# Altium schematic sheet NG2092_USB_HUB.SchDoc: =project_title
size Tabloid; PageSetup: Record=PageOptions|CenterHorizontal=True|CenterVertical=True|PrintScale=0.73|XCorrection=1.00|YCorrection=1.00|PrintKind=0|BorderSize=5000000|LeftOffset=0|BottomOffset=0|Orientation=2|PaperLength=1000|PaperWidth=1000|Scale=100|PaperSource=7|PrintQuality=-4|MediaType=1|DitherType=10|PaperKind=A4|PrintScaleMode=1; CompanyName: Luxonis Holding; Organization: Luxonis Holding; Address1: 1925 Harmony Park Drive; Address2: Westminster, CO; Address3: 80234; Address4: United States; SheetNumber: 8; SheetTotal: 12
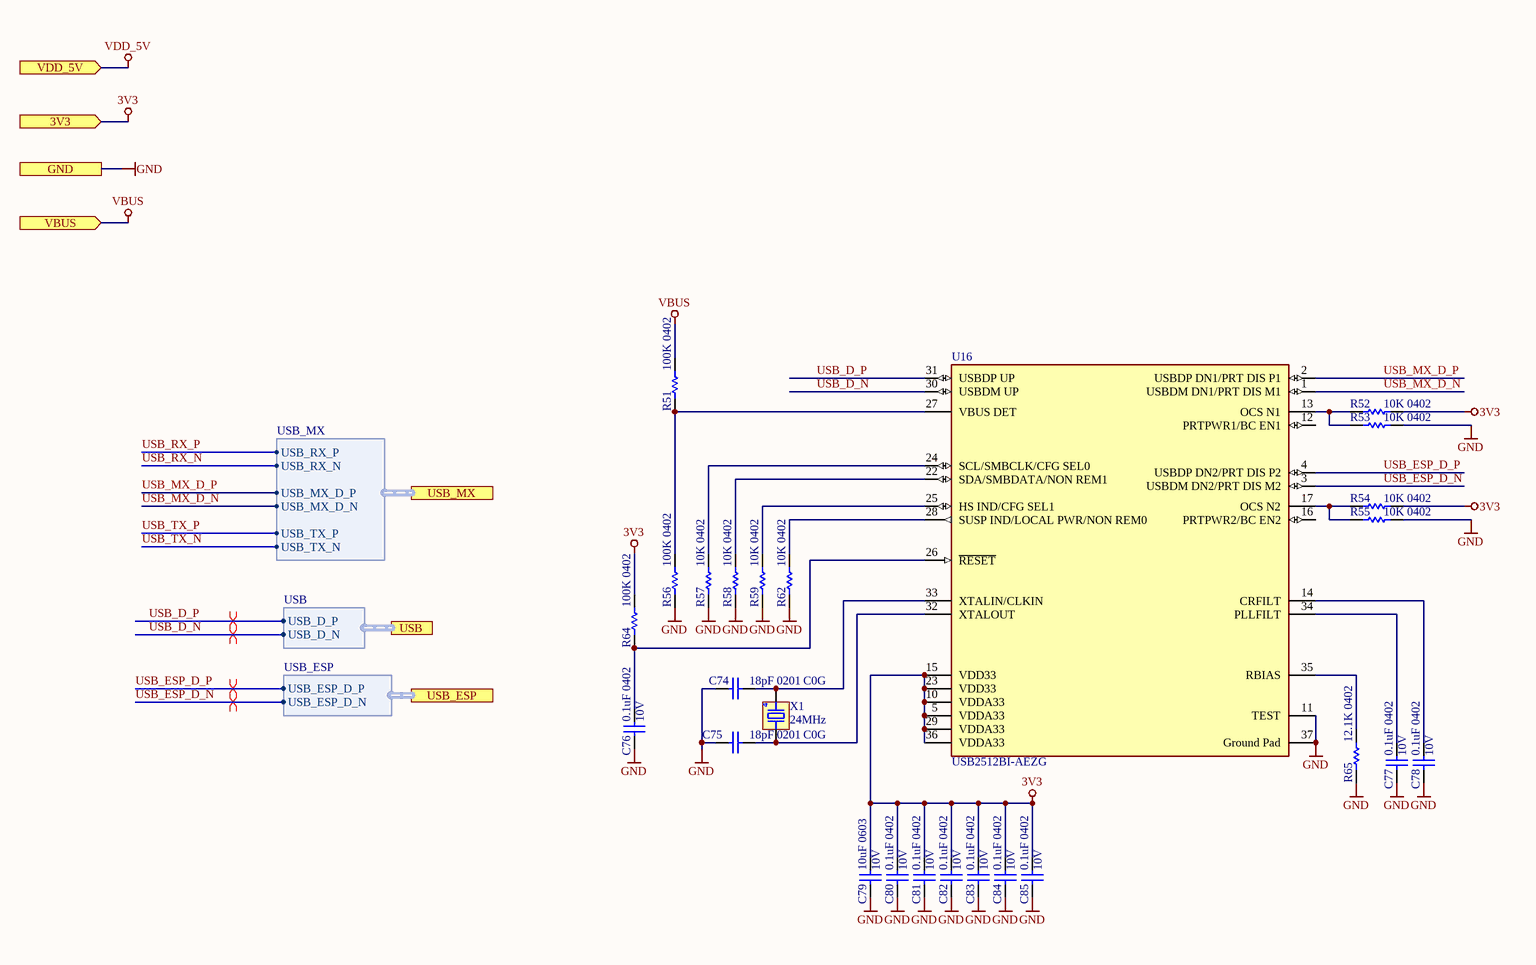
[diagram p0: NG2092_USB_HUB.SchDoc]

## Parts
C74  18pF 0201  Dielectric: C0G  [CAPC0201(0603)33_N]
C75  18pF 0201  Dielectric: C0G  [CAPC0201(0603)33_N]
C76  0.1uF 0402  Voltage Rating: 10V  [CAPC0402(1005)70_L]
C77  0.1uF 0402  Voltage Rating: 10V  [CAPC0402(1005)70_L]
C78  0.1uF 0402  Voltage Rating: 10V  [CAPC0402(1005)70_L]
C79  10uF 0603  Voltage Rating: 10V  [CAPC0603(1608)100_L]
C80  0.1uF 0402  Voltage Rating: 10V  [CAPC0402(1005)70_L]
C81  0.1uF 0402  Voltage Rating: 10V  [CAPC0402(1005)70_L]
C82  0.1uF 0402  Voltage Rating: 10V  [CAPC0402(1005)70_L]
C83  0.1uF 0402  Voltage Rating: 10V  [CAPC0402(1005)70_L]
C84  0.1uF 0402  Voltage Rating: 10V  [CAPC0402(1005)70_L]
C85  0.1uF 0402  Voltage Rating: 10V  [CAPC0402(1005)70_L]
R51  100K 0402  [RESC0402(1005)_L]
R52  10K 0402  [RESC0402(1005)_L]
R53  10K 0402  [RESC0402(1005)_L]
R54  10K 0402  [RESC0402(1005)_L]
R55  10K 0402  [RESC0402(1005)_L]
R56  100K 0402  [RESC0402(1005)_L]
R57  10K 0402  [RESC0402(1005)_L]
R58  10K 0402  [RESC0402(1005)_L]
R59  10K 0402  [RESC0402(1005)_L]
R62  10K 0402  [RESC0402(1005)_L]
R64  100K 0402  [RESC0402(1005)_L]
R65  12.1K 0402  [RESC0402(1005)_N]
U16  USB2512BI-AEZG  [QFN50P600X600X100_HS-37N]
X1  24MHz  [MCSJK-7U-24.00-12-30-60-B-30]

## Ports
3V3 (in), GND, USB (harness USB), USB_ESP (harness USB_ESP), USB_MX (harness USB_MX), VBUS (in), VDD_5V (in)

## Harnesses
USB: USB_D_P, USB_D_N
USB_ESP: USB_ESP_D_P, USB_ESP_D_N
USB_MX: USB_MX_D_P, USB_MX_D_N, USB_TX_N, USB_TX_P, USB_RX_N, USB_RX_P

## Nets
3V3: C79.2 C80.2 C81.2 C82.2 C83.2 C84.2 C85.2 R52.1 R54.1 R64.2 U16.5(VDDA33) U16.10(VDDA33) U16.15(VDD33) U16.23(VDD33) U16.29(VDDA33) U16.36(VDDA33) ; port 3V3
GND: C74.2 C75.2 C76.1 C77.1 C78.1 C79.1 C80.1 C81.1 C82.1 C83.1 C84.1 C85.1 R53.1 R55.1 R56.1 R57.1 R58.1 R59.1 R62.1 R65.1 U16.11(TEST) U16.37(Ground_Pad) ; port GND
VBUS: R51.2 ; port VBUS
VDD_5V: port VDD_5V
USB_D_N: U16.30(USBDM_UP) ; port USB.USB_D_N
USB_D_P: U16.31(USBDP_UP) ; port USB.USB_D_P
USB_ESP_D_N: U16.3(USBDM_DN2/PRT_DIS_M2) ; port USB_ESP.USB_ESP_D_N
USB_ESP_D_P: U16.4(USBDP_DN2/PRT_DIS_P2) ; port USB_ESP.USB_ESP_D_P
USB_MX_D_N: U16.1(USBDM_DN1/PRT_DIS_M1) ; port USB_MX.USB_MX_D_N
USB_MX_D_P: U16.2(USBDP_DN1/PRT_DIS_P1) ; port USB_MX.USB_MX_D_P
USB_RX_N: port USB_MX.USB_RX_N
USB_RX_P: port USB_MX.USB_RX_P
USB_TX_N: port USB_MX.USB_TX_N
USB_TX_P: port USB_MX.USB_TX_P
NetC74_1: C74.1 U16.33(XTALIN/CLKIN) X1.3(OSC2)
NetC75_1: C75.1 U16.32(XTALOUT) X1.1(OSC1)
NetC76_2: C76.2 R64.1 U16.26(~{RESET})
NetC77_2: C77.2 U16.34(PLLFILT)
NetC78_2: C78.2 U16.14(CRFILT)
NetR51_1: R51.1 R56.2 U16.27(VBUS_DET)
NetR52_2: R52.2 R53.2 U16.13(OCS_N1)
NetR54_2: R54.2 R55.2 U16.17(OCS_N2)
NetR57_2: R57.2 U16.24(SCL/SMBCLK/CFG_SEL0)
NetR58_2: R58.2 U16.22(SDA/SMBDATA/NON_REM1)
NetR59_2: R59.2 U16.25(HS_IND/CFG_SEL1)
NetR62_2: R62.2 U16.28(SUSP_IND/LOCAL_PWR/NON_REM0)
NetR65_2: R65.2 U16.35(RBIAS)

Not connected (* = marked no-connect by the designer): U16 6(NC) 7(NC) 8(NC) 9(NC) 12(PRTPWR1/BC_EN1) 16(PRTPWR2/BC_EN2) 18(NC) 19(NC) 20(NC) 21(NC); X1 2(GND) 4(GND)

## Layout directives
differential pair; differential pair class 90ohm: USB_D_N, USB_D_P, USB_ESP_D_N, USB_ESP_D_P

## Notes on the sheet
- Title
- Size:
- Date:
- Tabloid
- Number:
- Time:
- Revision:
- Sheet
- of
- Drawn by:

## Library data of the parts
C74 C75 = GRM0335C1E180FA01D: Cap Ceramic 18pF 25V C0G 1% Pad SMD 0201 125C T/R; Manufacturer 1: Murata; Supplier 1: Digi-Key; Manufacturer Part Number 1: GRM0335C1E180FA01D; RoHS: Yes; Category: Ceramic Capacitors; Stock 1: 27511; Pricing 1: 1=0.10000, 10=0.02100, 100=0.00930, 500=0.00666, 1000=0.00523, 2500=0.00476, 5000=0.00438 (USD); Mount: Surface Mount; Case/Package: 0201; Case Code (Imperial): 0201; Case Code (Metric): 0603; Min Operating Temperature: -55°C; Max Operating Temperature: 125°C; Capacitance: 18pF; Tolerance: 1%; Packaging: Tape and Reel; Voltage Rating (DC): 25V; Package Quantity: 15000; Voltage Rating: 25V; Termination: SMD/SMT; Length: 0.024inch; Height: 0.3mm; Thickness: 0.013inch; Width: 0.3mm; ComponentLink1URL: https://datasheet.ciiva.com/29538/partnumbering-e-01-29538328.pdf?src-supplier=Digi-Key; ComponentLink1Description: https://datasheet.ciiva.com/29538/partnumbering-e-01-29538328.pdf?src-supplier=Digi-Key; Supplier 2: Digi-Key; Supplier 3: Mouser; Supplier Part Number 3: 81-GRM0335C1E180FA1D; Supplier Part Number 2: 490-17804-2-ND; Supplier Part Number 1: 490-17804-1-ND
C76-C78 C80-C85 = GRM155R71A104JA01D: CAP CER 0.1UF 10V X7R 0402 5%; Manufacturer 1: Murata; Capacitance: 100nF; Supplier 1: Digi-Key; Manufacturer Part Number 1: GRM155R71A104JA01D; Stock 1: 1346709; Pricing 1: 1=0.10000, 10=0.02500, 100=0.01130, 500=0.00806, 1000=0.00633, 2500=0.00575, 5000=0.00529 (USD); RoHS: Yes; Mount: Surface Mount; Case/Package: 0402; Case Code (Imperial): 0402; Case Code (Metric): 1005; Min Operating Temperature: -55°C; Max Operating Temperature: 125°C; Tolerance: 5%; Packaging: Tape and Reel; Voltage Rating (DC): 10V; Dielectric: X7R; Package Quantity: 10000; Termination: SMD/SMT; Length: 1mm; Height: 0.5mm; Width: 0.02inch; Thickness: 0.022inch; Depth: 0.5mm; Radiation Hardening: No; Lead Free: Lead Free; ComponentLink1URL: https://datasheet.ciiva.com/5411/product-5411135.pdf?src-supplier=Mouser; ComponentLink1Description: https://datasheet.ciiva.com/5411/product-5411135.pdf?src-supplier=Mouser; ComponentLink2URL: https://datasheet.ciiva.com/11618/c02e-11618821.pdf?src-supplier=Avnet; ComponentLink2Description: https://datasheet.ciiva.com/11618/c02e-11618821.pdf?src-supplier=Avnet; Supplier Part Number 1: 490-10777-1-ND
C79 = GRM188R61A106ME69D: CAP CER 10UF 10V X5R 0603 20%; Manufacturer 1: Murata; Material: Ceramic; Supplier 1: Digi-Key; Manufacturer Part Number 1: GRM188R61A106ME69D; Stock 1: 2873098; Pricing 1: 1=0.21000, 10=0.14100, 100=0.07130, 500=0.04876, 1000=0.04313 (USD); RoHS: Yes; Mount: Surface Mount; Case/Package: 0603; Weight: 0.000222oz; Case Code (Metric): 1608; Case Code (Imperial): 0603; Min Operating Temperature: -55°C; Max Operating Temperature: 85°C; Packaging: Tape and Reel; Tolerance: 20%; Capacitance: 10uF; Dielectric: X5R; Voltage Rating (DC): 10V; Package Quantity: 4000; Termination: SMD/SMT; Length: 1.6mm; Height: 0.8mm; Width: 0.8mm; Thickness: 0.035inch; Depth: 0.8mm; REACH SVHC: Unknown; Lead Free: Lead Free; ComponentLink1URL: http://www.mouser.com/ds/2/281/c02e-2905.pdf?src-supplier=Mouser; ComponentLink1Description: http://www.mouser.com/ds/2/281/c02e-2905.pdf?src-supplier=Mouser; ComponentLink2URL: http://components.arrow.com/part/dataview/0323_06119472?src-supplier=Arrow+Europe; ComponentLink2Description: http://components.arrow.com/part/dataview/0323_06119472?src-supplier=Arrow+Europe; ComponentLink3URL: http://www.farnell.com/datasheets/2048014.pdf?src-supplier=Farnell; ComponentLink3Description: http://www.farnell.com/datasheets/2048014.pdf?src-supplier=Farnell; ComponentLink4URL: http://www.farnell.com/datasheets/1872210.pdf?src-supplier=Farnell; ComponentLink4Description: http://www.farnell.com/datasheets/1872210.pdf?src-supplier=Farnell; ComponentLink5URL: http://search.murata.co.jp/Ceramy/image/img/A01X/G101/ENG/GRM188R61A106ME69-01.pdf?src-supplier=Digi-Key; ComponentLink5Description: http://search.murata.co.jp/Ceramy/image/img/A01X/G101/ENG/GRM188R61A106ME69-01.pdf?src-supplier=Digi-Key; ComponentLink6URL: http://www.farnell.com/datasheets/1872210.pdf?src-supplier=Newark; ComponentLink6Description: http://www.farnell.com/datasheets/1872210.pdf?src-supplier=Newark; ComponentLink7URL: http://www.farnell.com/datasheets/2048014.pdf?src-supplier=Element14; ComponentLink7Description: http://www.farnell.com/datasheets/2048014.pdf?src-supplier=Element14; ComponentLink8URL: http://www.farnell.com/datasheets/2048014.pdf?src-supplier=Newark; ComponentLink8Description: http://www.farnell.com/datasheets/2048014.pdf?src-supplier=Newark; Supplier Part Number 1: 490-10475-1-ND
R51 R56 R64 = RC0402FR-07100KL: RES SMD 100K OHM 1% 1/16W 0402; Manufacturer 1: Yageo; Power Rating: 63mW; Resistance: 100kR; Temperature Coefficient: 100ppm/°C; Voltage Rating: 50V; Supplier 1: Digi-Key; Manufacturer Part Number 1: RC0402FR-07100KL; Stock 1: 50867324; Pricing 1: 1=0.10000, 10=0.01500, 100=0.00600, 1000=0.00270, 2500=0.00235, 5000=0.00194 (USD); RoHS: Yes; Case/Package: 0402; Case Code (Metric): 1005; Case Code (Imperial): 0402; Min Operating Temperature: -55°C; Max Operating Temperature: 155°C; Tolerance: 1%; Packaging: Tape and Reel; Composition: Thick Film; Termination: SMD/SMT; Military Standard: Not; Package Quantity: 1; Number of Terminations: 2; Max Power Dissipation: 63mW; Features: Moisture Resistant; Working Voltage: 50V; Length: 0.039inch; Height: 0.016inch; Width: 0.02inch; Depth: 0.5mm; Lead Free: Lead Free; REACH SVHC: No SVHC; ComponentLink1URL: https://datasheet.ciiva.com/11819/0900766b80c66297-11819452.pdf?src-supplier=RSComponents; ComponentLink1Description: https://datasheet.ciiva.com/11819/0900766b80c66297-11819452.pdf?src-supplier=RSComponents; ComponentLink2URL: https://datasheet.ciiva.com/2453/pyu-r-int-thick-7-2453361.pdf?src-supplier=Digi-Key; ComponentLink2Description: https://datasheet.ciiva.com/2453/pyu-r-int-thick-7-2453361.pdf?src-supplier=Digi-Key; ComponentLink3URL: https://datasheet.ciiva.com/2453/pyu-r-int-thick-7-2453362.pdf?src-supplier=Digi-Key; ComponentLink3Description: https://datasheet.ciiva.com/2453/pyu-r-int-thick-7-2453362.pdf?src-supplier=Digi-Key; ComponentLink4URL: https://datasheet.ciiva.com/2453/pyu-r-int-thick-7-2453363.pdf?src-supplier=Digi-Key; ComponentLink4Description: https://datasheet.ciiva.com/2453/pyu-r-int-thick-7-2453363.pdf?src-supplier=Digi-Key; ComponentLink5URL: https://datasheet.ciiva.com/22747/1018594-22747509.pdf?src-supplier=Element14; ComponentLink5Description: https://datasheet.ciiva.com/22747/1018594-22747509.pdf?src-supplier=Element14; ComponentLink6URL: https://datasheet.ciiva.com/15189/getdatasheetpartid-323696-15189334.pdf?src-supplier=Verical; ComponentLink6Description: https://datasheet.ciiva.com/15189/getdatasheetpartid-323696-15189334.pdf?src-supplier=Verical; ComponentLink7URL: https://datasheet.ciiva.com/12667/pyu-rc0402-51-rohs-l-6-r-12667930.pdf?src-supplier=Mouser; ComponentLink7Description: https://datasheet.ciiva.com/12667/pyu-rc0402-51-rohs-l-6-r-12667930.pdf?src-supplier=Mouser; Supplier 2: Newark; Supplier 3: Mouser; Supplier Part Number 1: 311-100KLRCT-ND; Supplier Part Number 2: 67R9887; Supplier Part Number 3: 603-RC0402FR-07100KL
R52-R55 R57-R59 R62 = RC0402FR-1310KL: RES SMD 10K OHM 1% 0402 1/16W Chip Resistor, 0402 [1005 Metric], 10 kohm, RC Series, 50 V, Thick Film, 62.5 mW; Manufacturer 1: Yageo; Resistance: 10kR; Temperature Coefficient: 100ppm/°C; Power Rating: 62.5mW; Voltage Rating: 50V; ComponentLink1URL: https://datasheet.ciiva.com/16940/pyu-rc0402-51-rohs-l-6-16940293.pdf?src-supplier=Avnet+Europe; ComponentLink1Description: https://datasheet.ciiva.com/16940/pyu-rc0402-51-rohs-l-6-16940293.pdf?src-supplier=Avnet+Europe; ComponentLink2URL: https://datasheet.ciiva.com/28386/pyu-rc0402-51-rohs-l-6-28386855.pdf?src-supplier=Avnet+Europe; ComponentLink2Description: https://datasheet.ciiva.com/28386/pyu-rc0402-51-rohs-l-6-28386855.pdf?src-supplier=Avnet+Europe; ComponentLink3URL: https://datasheet.ciiva.com/16740/pyu-rc0402-51-rohs-l-6-r-16740602.pdf?src-supplier=Future+Electronics; ComponentLink3Description: https://datasheet.ciiva.com/16740/pyu-rc0402-51-rohs-l-6-r-16740602.pdf?src-supplier=Future+Electronics; ComponentLink4URL: https://datasheet.ciiva.com/8891/pyu-rc0402-51-rohs-l-6-8891339.pdf?src-supplier=Avnet; ComponentLink4Description: https://datasheet.ciiva.com/8891/pyu-rc0402-51-rohs-l-6-8891339.pdf?src-supplier=Avnet; ComponentLink5URL: https://datasheet.ciiva.com/5557/pyu-rc0402-51-rohs-l-6-r-5557997.pdf?src-supplier=Mouser; ComponentLink5Description: https://datasheet.ciiva.com/5557/pyu-rc0402-51-rohs-l-6-r-5557997.pdf?src-supplier=Mouser; ComponentLink6URL: https://datasheet.ciiva.com/7983/1018594-7983533.pdf?src-supplier=Element14; ComponentLink6Description: https://datasheet.ciiva.com/7983/1018594-7983533.pdf?src-supplier=Element14; Supplier 1: Newark; Manufacturer Part Number 1: RC0402FR-1310KL; Stock 1: 62239; Pricing 1: 1=0.10000, 25=0.01200, 100=0.00400, 250=0.00400, 500=0.00300, 1000=0.00300 (USD); RoHS: Yes; Case/Package: 0402; Number of Pins: 2; Contact Plating: Tin,Matte,Lead; Case Code (Imperial): 0402; Case Code (Metric): 1005; Min Operating Temperature: -55°C; Max Operating Temperature: 155°C; Tolerance: 1%; Composition: Thick Film; Packaging: Tape and Reel; Termination: SMD/SMT; Military Standard: Not; Voltage Rating (DC): 50V; Working Voltage: 50V; Number of Terminations: 2; Length: 1mm; Depth: 0.5mm; Radiation Hardening: No; REACH SVHC: No SVHC; Lead Free: Lead Free; Supplier Part Number 1: 67R9960; Supplier 2: Future Electronics; Supplier 3: Mouser; Supplier 4: Element14; Supplier Part Number 2: RC0402FR-1310KL-CUTT; Supplier Part Number 3: 603-RC0402FR-1310KL; Supplier Part Number 4: 1799235
R65 = RC0402FR-0712K1L: RES SMD 12.1K OHM 1% 1/16W 0402; Manufacturer 1: Yageo; Additional Feature: LASER TRIMMABLE; Rated Power Dissipation (P): 62.5mW; Rated Temperature: 70°C; Resistance: 12.1kR; Temperature Coefficient: 100ppm/°C; Working Voltage: 50V; Package Height: 0.35mm; Package Length: 1mm; Package Width: 0.5mm; Supplier 1: Avnet; RoHS: Yes; Category: Chip SMD Resistors; Mount: Surface Mount; Number of Pins: 2; Package Shape: Rectangular; Size Code: 0402; Terminal Finish: Nickel; Min Operating Temperature: -55°C; Max Operating Temperature: 155°C; Tolerance: 1%; JESD-609 Code: e3; Resistor Type: FIXED RESISTOR; Construction: Chip; Package Style: SMTMeter; Packaging: Tape and Reel; Technology: METAL GLAZE/THICK FILM; Termination: Wraparound; REACH SVHC: Yes; RoHS Compliant: Yes; ComponentLink1URL: https://datasheet.ciiva.com:443/pdfs/VipMasterIC/IC/YAGO/YAGO-S-A0008145938/YAGO-S-A0008145938-1.pdf?src-supplier=IHS+Markit; ComponentLink1Description: https://datasheet.ciiva.com:443/pdfs/VipMasterIC/IC/YAGO/YAGO-S-A0008145938/YAGO-S-A0008145938-1.pdf?src-supplier=IHS+Markit; ComponentLink2URL: https://datasheet.ciiva.com/11808/0900766b80d8d3b8-11808222.pdf?src-supplier=RSComponents; ComponentLink2Description: https://datasheet.ciiva.com/11808/0900766b80d8d3b8-11808222.pdf?src-supplier=RSComponents; ComponentLink3URL: https://datasheet.ciiva.com/2453/pyu-r-int-thick-7-2453488.pdf?src-supplier=Digi-Key; ComponentLink3Description: https://datasheet.ciiva.com/2453/pyu-r-int-thick-7-2453488.pdf?src-supplier=Digi-Key; ComponentLink4URL: https://datasheet.ciiva.com/2453/pyu-r-int-thick-7-2453489.pdf?src-supplier=Digi-Key; ComponentLink4Description: https://datasheet.ciiva.com/2453/pyu-r-int-thick-7-2453489.pdf?src-supplier=Digi-Key; ComponentLink5URL: https://datasheet.ciiva.com/7983/1018594-7983493.pdf?src-supplier=Element14; ComponentLink5Description: https://datasheet.ciiva.com/7983/1018594-7983493.pdf?src-supplier=Element14; ComponentLink6URL: https://datasheet.ciiva.com/2453/pyu-r-int-thick-7-2453487.pdf?src-supplier=Digi-Key; ComponentLink6Description: https://datasheet.ciiva.com/2453/pyu-r-int-thick-7-2453487.pdf?src-supplier=Digi-Key; ComponentLink7URL: https://datasheet.ciiva.com/17070/pyu-rc0402-51-rohs-l-6-r-17070757.pdf?src-supplier=Future+Electronics; ComponentLink7Description: https://datasheet.ciiva.com/17070/pyu-rc0402-51-rohs-l-6-r-17070757.pdf?src-supplier=Future+Electronics; Supplier Part Number 1: RC0402FR-0712K1L; Manufacturer Part Number 1: RC0402FR-0712K1L; Stock 1: 60000; Pricing 1: 10000=0,00090, 20000=0,00088, 40000=0,00086, 60000=0,00084, 80000=0,00081, 100000=0,00079, 1000000=0,00077 (USD)
U16 = USB2512BI-AEZG: IC USB 2.0 2PORT HUB CTLR 36QFN; Manufacturer 1: Microchip; RoHS: Yes; Category: USB Interface ICs; ComponentLink2Description: https://datasheet.ciiva.com/23943/1754405-23943458.pdf?src-supplier=Newark; ComponentLink2URL: https://datasheet.ciiva.com/23943/1754405-23943458.pdf?src-supplier=Newark; Manufacturer Part Number 1: USB2512BI-AEZG; Supplier 1: RSComponents; ComponentLink1URL: https://datasheet.ciiva.com/16366/usb2512bi-aezg-16366528.pdf?src-supplier=Future+Electronics; ComponentLink1Description: https://datasheet.ciiva.com/16366/usb2512bi-aezg-16366528.pdf?src-supplier=Future+Electronics; ComponentLink3URL: https://datasheet.ciiva.com/14820/251xb1-14820225.pdf?src-supplier=Arrow+Electronics; ComponentLink3Description: https://datasheet.ciiva.com/14820/251xb1-14820225.pdf?src-supplier=Arrow+Electronics; ComponentLink4URL: https://datasheet.ciiva.com/26344/651861-da-01-en-usb-ctlr-usb2512bi-aezg-qfn-36-6x6-mcp-26344422.pdf?src-supplier=Conrad; ComponentLink4Description: https://datasheet.ciiva.com/26344/651861-da-01-en-usb-ctlr-usb2512bi-aezg-qfn-36-6x6-mcp-26344422.pdf?src-supplier=Conrad; Supplier Part Number 1: 8251127; Stock 1: 1; Pricing 1: 5=2,82800, 25=2,74400, 100=2,64300 (USD)
X1 = ABM8G-24.000MHZ-4Y-T3: CRYSTAL 24.0000MHZ 10PF SMD; Manufacturer 1: Abracon; Supplier 1: Digi-Key; RoHS: Yes; Category: Crystals; ComponentLink1URL: https://datasheet.ciiva.com/854/abm8g-854913.pdf?src-supplier=Digi-Key; ComponentLink1Description: https://datasheet.ciiva.com/854/abm8g-854913.pdf?src-supplier=Digi-Key; ComponentLink2URL: https://datasheet.ciiva.com/854/abm8g-854911.pdf?src-supplier=Digi-Key; ComponentLink2Description: https://datasheet.ciiva.com/854/abm8g-854911.pdf?src-supplier=Digi-Key; ComponentLink3URL: https://datasheet.ciiva.com/854/abm8g-854912.pdf?src-supplier=Digi-Key; ComponentLink3Description: https://datasheet.ciiva.com/854/abm8g-854912.pdf?src-supplier=Digi-Key; Supplier Part Number 1: 535-10913-1-ND; Manufacturer Part Number 1: ABM8G-24.000MHZ-4Y-T3; Stock 1: 4722; Pricing 1: 1=0,67000, 10=0,59600, 50=0,55720, 100=0,49250, 500=0,46656, 1000=0,38880 (USD)